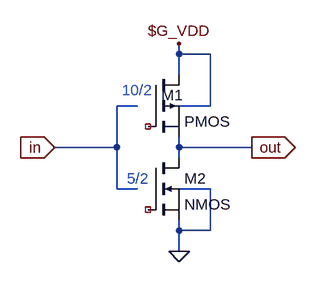
[diagram p0: schematic inverter.asc]
inverter.asc, the LTspice schematic file:
Version 4
SHEET 1 1292 836
WIRE -624 -80 -624 -96
WIRE -576 -80 -624 -80
WIRE -624 -48 -624 -80
WIRE -688 0 -720 0
WIRE -576 0 -576 -80
WIRE -576 0 -624 0
WIRE -720 64 -720 0
WIRE -720 64 -816 64
WIRE -624 64 -624 48
WIRE -512 64 -624 64
WIRE -624 80 -624 64
WIRE -720 128 -720 64
WIRE -688 128 -720 128
WIRE -576 128 -624 128
WIRE -624 192 -624 176
WIRE -576 192 -576 128
WIRE -576 192 -624 192
WIRE -624 224 -624 192
FLAG -624 224 0
FLAG -816 64 in
IOPIN -816 64 In
FLAG -512 64 out
IOPIN -512 64 Out
FLAG -624 -96 $G_VDD
SYMBOL pmos -672 -48 R0
WINDOW 0 21 31 Left 2
SYMATTR InstName M1
SYMATTR Value2 l=0.6u w=3u
SYMATTR SpiceModel ""
SYMATTR Value PMOS
SYMBOL nmos -672 80 R0
SYMATTR InstName M2
SYMATTR Value2 l=0.6u w=1.5u
SYMATTR Value NMOS
TEXT -712 -24 Left 2 ;10/2
TEXT -704 112 Left 2 ;5/2

The netlist it stands for:
* inverter.asc
* M1: PMOS l=0.6u w=3u (symbol pmos not certain, pin order unknown); nets seen at it: $G_VDD, out
* M2: NMOS l=0.6u w=1.5u (symbol nmos not certain, pin order unknown); nets seen at it: 0, out
* 10/2
* 5/2
.backanno
.end